# Altium project Street_light_LED_hv2.PrjPcb
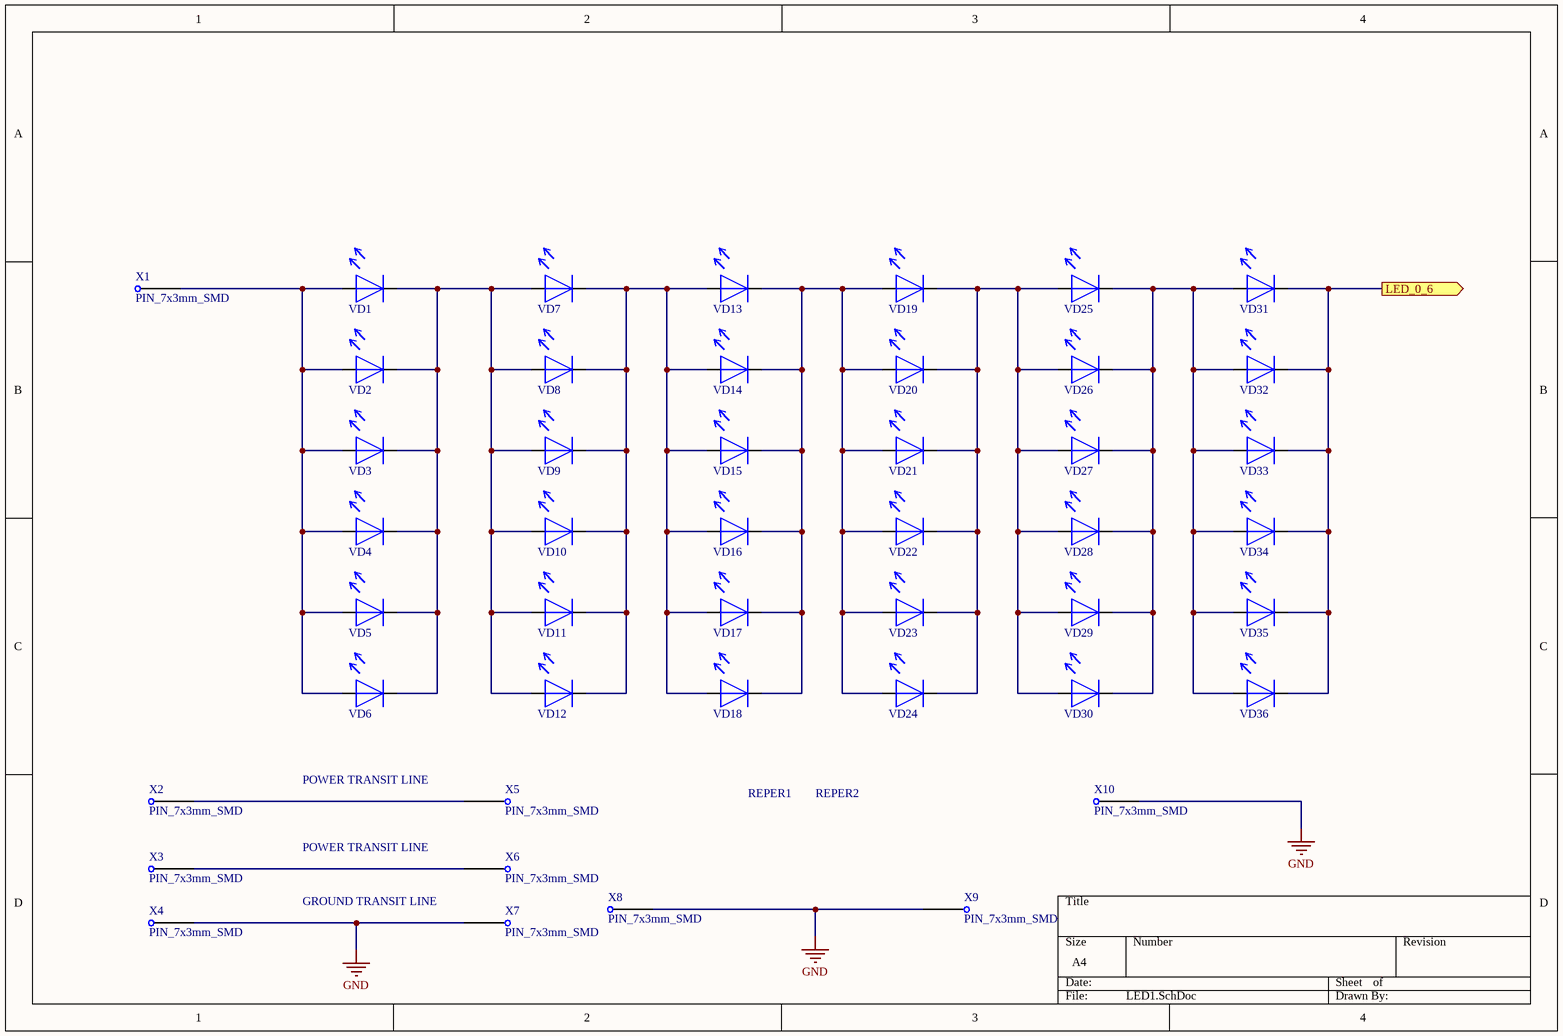
[diagram p0: LED1.SchDoc]
4 sheets, 144 parts. Net scope: flat (ports and power ports of the same name join across sheets).
Board file: Street_light_LED_hv2.PcbDoc
Sheets:
  LED1.SchDoc
  LED2.SchDoc
  LED3.SchDoc
  LED4.SchDoc

## Sheet LED1.SchDoc
size A4

### Parts
1  REPER1  [REPER1.2]
2  REPER2  [REPER1.2]
VD1  SPMWHT541MD5WAT0SB  [LED_Samsung]  (value not drawn)
VD2  SPMWHT541MD5WAT0SB  [LED_Samsung]  (value not drawn)
VD3  SPMWHT541MD5WAT0SB  [LED_Samsung]  (value not drawn)
VD4  SPMWHT541MD5WAT0SB  [LED_Samsung]  (value not drawn)
VD5  SPMWHT541MD5WAT0SB  [LED_Samsung]  (value not drawn)
VD6  SPMWHT541MD5WAT0SB  [LED_Samsung]  (value not drawn)
VD7  SPMWHT541MD5WAT0SB  [LED_Samsung]  (value not drawn)
VD8  SPMWHT541MD5WAT0SB  [LED_Samsung]  (value not drawn)
VD9  SPMWHT541MD5WAT0SB  [LED_Samsung]  (value not drawn)
VD10  SPMWHT541MD5WAT0SB  [LED_Samsung]  (value not drawn)
VD11  SPMWHT541MD5WAT0SB  [LED_Samsung]  (value not drawn)
VD12  SPMWHT541MD5WAT0SB  [LED_Samsung]  (value not drawn)
VD13  SPMWHT541MD5WAT0SB  [LED_Samsung]  (value not drawn)
VD14  SPMWHT541MD5WAT0SB  [LED_Samsung]  (value not drawn)
VD15  SPMWHT541MD5WAT0SB  [LED_Samsung]  (value not drawn)
VD16  SPMWHT541MD5WAT0SB  [LED_Samsung]  (value not drawn)
VD17  SPMWHT541MD5WAT0SB  [LED_Samsung]  (value not drawn)
VD18  SPMWHT541MD5WAT0SB  [LED_Samsung]  (value not drawn)
VD19  SPMWHT541MD5WAT0SB  [LED_Samsung]  (value not drawn)
VD20  SPMWHT541MD5WAT0SB  [LED_Samsung]  (value not drawn)
VD21  SPMWHT541MD5WAT0SB  [LED_Samsung]  (value not drawn)
VD22  SPMWHT541MD5WAT0SB  [LED_Samsung]  (value not drawn)
VD23  SPMWHT541MD5WAT0SB  [LED_Samsung]  (value not drawn)
VD24  SPMWHT541MD5WAT0SB  [LED_Samsung]  (value not drawn)
VD25  SPMWHT541MD5WAT0SB  [LED_Samsung]  (value not drawn)
VD26  SPMWHT541MD5WAT0SB  [LED_Samsung]  (value not drawn)
VD27  SPMWHT541MD5WAT0SB  [LED_Samsung]  (value not drawn)
VD28  SPMWHT541MD5WAT0SB  [LED_Samsung]  (value not drawn)
VD29  SPMWHT541MD5WAT0SB  [LED_Samsung]  (value not drawn)
VD30  SPMWHT541MD5WAT0SB  [LED_Samsung]  (value not drawn)
VD31  SPMWHT541MD5WAT0SB  [LED_Samsung]  (value not drawn)
VD32  SPMWHT541MD5WAT0SB  [LED_Samsung]  (value not drawn)
VD33  SPMWHT541MD5WAT0SB  [LED_Samsung]  (value not drawn)
VD34  SPMWHT541MD5WAT0SB  [LED_Samsung]  (value not drawn)
VD35  SPMWHT541MD5WAT0SB  [LED_Samsung]  (value not drawn)
VD36  SPMWHT541MD5WAT0SB  [LED_Samsung]  (value not drawn)
X1  PIN_7x3mm_SMD  [PIN_7x3mm_SMD]
X2  PIN_7x3mm_SMD  [PIN_7x3mm_SMD]
X3  PIN_7x3mm_SMD  [PIN_7x3mm_SMD]
X4  PIN_7x3mm_SMD  [PIN_7x3mm_SMD]
X5  PIN_7x3mm_SMD  [PIN_7x3mm_SMD]
X6  PIN_7x3mm_SMD  [PIN_7x3mm_SMD]
X7  PIN_7x3mm_SMD  [PIN_7x3mm_SMD]
X8  PIN_7x3mm_SMD  [PIN_7x3mm_SMD]
X9  PIN_7x3mm_SMD  [PIN_7x3mm_SMD]
X10  PIN_7x3mm_SMD  [PIN_7x3mm_SMD]

### Ports
LED_0_6 (out)

### Nets
GND: X4.1 X7.1 X8.1 X9.1 X10.1
NetVD1_1: VD1.1 VD2.1 VD3.1 VD4.1 VD5.1 VD6.1 X1.1
NetVD1_2: VD1.2 VD2.2 VD3.2 VD4.2 VD5.2 VD6.2 VD7.1 VD8.1 VD9.1 VD10.1 VD11.1 VD12.1
NetVD7_2: VD7.2 VD8.2 VD9.2 VD10.2 VD11.2 VD12.2 VD13.1 VD14.1 VD15.1 VD16.1 VD17.1 VD18.1
NetVD13_2: VD13.2 VD14.2 VD15.2 VD16.2 VD17.2 VD18.2 VD19.1 VD20.1 VD21.1 VD22.1 VD23.1 VD24.1
NetVD19_2: VD19.2 VD20.2 VD21.2 VD22.2 VD23.2 VD24.2 VD25.1 VD26.1 VD27.1 VD28.1 VD29.1 VD30.1
NetVD25_2: VD25.2 VD26.2 VD27.2 VD28.2 VD29.2 VD30.2 VD31.1 VD32.1 VD33.1 VD34.1 VD35.1 VD36.1
NetVD31_2: VD31.2 VD32.2 VD33.2 VD34.2 VD35.2 VD36.2 ; port LED_0_6
NetX2_1: X2.1 X5.1
NetX3_1: X3.1 X6.1

Not connected (* = marked no-connect by the designer): 1 1; 2 1

### Notes on the sheet
- POWER TRANSIT LINE
- GROUND TRANSIT LINE

### Library data of the parts
1 2 = REPER1.2
  1: Value: REPER1
  2: Value: REPER2
VD1-VD36 = LED SPMWHT541MD5WAT0SB: Value: SPMWHT541MD5WAT0SB

## Sheet LED2.SchDoc
size A4
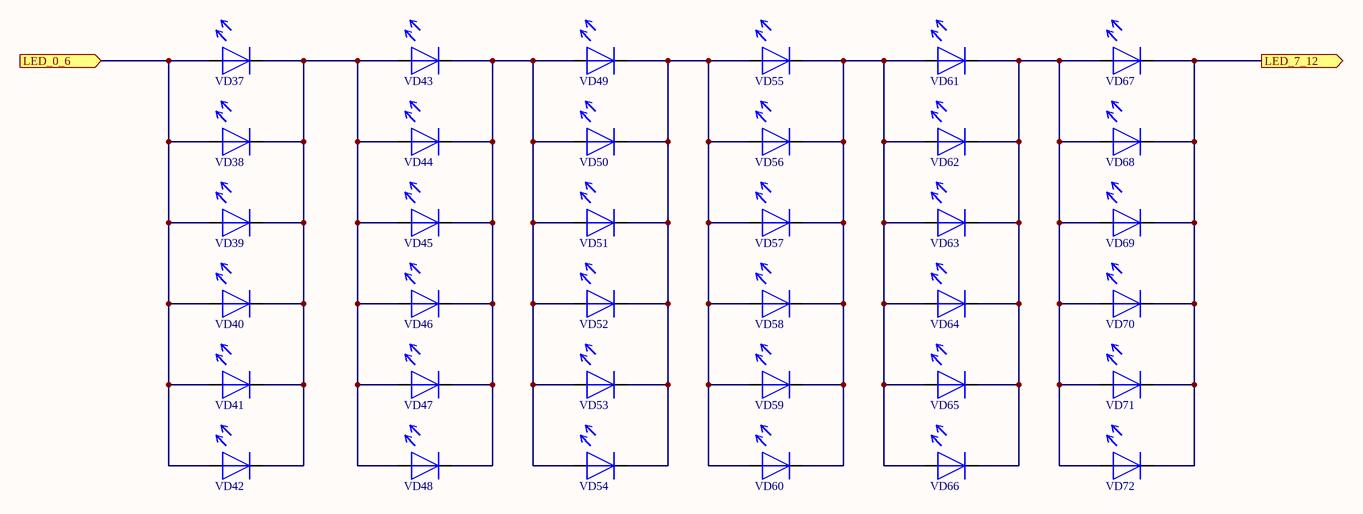
[diagram p1: LED2.SchDoc]

### Parts
VD37  SPMWHT541MD5WAT0SB  [LED_Samsung]  (value not drawn)
VD38  SPMWHT541MD5WAT0SB  [LED_Samsung]  (value not drawn)
VD39  SPMWHT541MD5WAT0SB  [LED_Samsung]  (value not drawn)
VD40  SPMWHT541MD5WAT0SB  [LED_Samsung]  (value not drawn)
VD41  SPMWHT541MD5WAT0SB  [LED_Samsung]  (value not drawn)
VD42  SPMWHT541MD5WAT0SB  [LED_Samsung]  (value not drawn)
VD43  SPMWHT541MD5WAT0SB  [LED_Samsung]  (value not drawn)
VD44  SPMWHT541MD5WAT0SB  [LED_Samsung]  (value not drawn)
VD45  SPMWHT541MD5WAT0SB  [LED_Samsung]  (value not drawn)
VD46  SPMWHT541MD5WAT0SB  [LED_Samsung]  (value not drawn)
VD47  SPMWHT541MD5WAT0SB  [LED_Samsung]  (value not drawn)
VD48  SPMWHT541MD5WAT0SB  [LED_Samsung]  (value not drawn)
VD49  SPMWHT541MD5WAT0SB  [LED_Samsung]  (value not drawn)
VD50  SPMWHT541MD5WAT0SB  [LED_Samsung]  (value not drawn)
VD51  SPMWHT541MD5WAT0SB  [LED_Samsung]  (value not drawn)
VD52  SPMWHT541MD5WAT0SB  [LED_Samsung]  (value not drawn)
VD53  SPMWHT541MD5WAT0SB  [LED_Samsung]  (value not drawn)
VD54  SPMWHT541MD5WAT0SB  [LED_Samsung]  (value not drawn)
VD55  SPMWHT541MD5WAT0SB  [LED_Samsung]  (value not drawn)
VD56  SPMWHT541MD5WAT0SB  [LED_Samsung]  (value not drawn)
VD57  SPMWHT541MD5WAT0SB  [LED_Samsung]  (value not drawn)
VD58  SPMWHT541MD5WAT0SB  [LED_Samsung]  (value not drawn)
VD59  SPMWHT541MD5WAT0SB  [LED_Samsung]  (value not drawn)
VD60  SPMWHT541MD5WAT0SB  [LED_Samsung]  (value not drawn)
VD61  SPMWHT541MD5WAT0SB  [LED_Samsung]  (value not drawn)
VD62  SPMWHT541MD5WAT0SB  [LED_Samsung]  (value not drawn)
VD63  SPMWHT541MD5WAT0SB  [LED_Samsung]  (value not drawn)
VD64  SPMWHT541MD5WAT0SB  [LED_Samsung]  (value not drawn)
VD65  SPMWHT541MD5WAT0SB  [LED_Samsung]  (value not drawn)
VD66  SPMWHT541MD5WAT0SB  [LED_Samsung]  (value not drawn)
VD67  SPMWHT541MD5WAT0SB  [LED_Samsung]  (value not drawn)
VD68  SPMWHT541MD5WAT0SB  [LED_Samsung]  (value not drawn)
VD69  SPMWHT541MD5WAT0SB  [LED_Samsung]  (value not drawn)
VD70  SPMWHT541MD5WAT0SB  [LED_Samsung]  (value not drawn)
VD71  SPMWHT541MD5WAT0SB  [LED_Samsung]  (value not drawn)
VD72  SPMWHT541MD5WAT0SB  [LED_Samsung]  (value not drawn)

### Ports
LED_0_6 (in), LED_7_12 (out)

### Nets
NetVD31_2: VD37.1 VD38.1 VD39.1 VD40.1 VD41.1 VD42.1 ; port LED_0_6
NetVD37_2: VD37.2 VD38.2 VD39.2 VD40.2 VD41.2 VD42.2 VD43.1 VD44.1 VD45.1 VD46.1 VD47.1 VD48.1
NetVD43_2: VD43.2 VD44.2 VD45.2 VD46.2 VD47.2 VD48.2 VD49.1 VD50.1 VD51.1 VD52.1 VD53.1 VD54.1
NetVD49_2: VD49.2 VD50.2 VD51.2 VD52.2 VD53.2 VD54.2 VD55.1 VD56.1 VD57.1 VD58.1 VD59.1 VD60.1
NetVD55_2: VD55.2 VD56.2 VD57.2 VD58.2 VD59.2 VD60.2 VD61.1 VD62.1 VD63.1 VD64.1 VD65.1 VD66.1
NetVD61_2: VD61.2 VD62.2 VD63.2 VD64.2 VD65.2 VD66.2 VD67.1 VD68.1 VD69.1 VD70.1 VD71.1 VD72.1
NetVD67_2: VD67.2 VD68.2 VD69.2 VD70.2 VD71.2 VD72.2 ; port LED_7_12

### Library data of the parts
VD37-VD72 = LED SPMWHT541MD5WAT0SB: Value: SPMWHT541MD5WAT0SB

## Sheet LED3.SchDoc
size A4
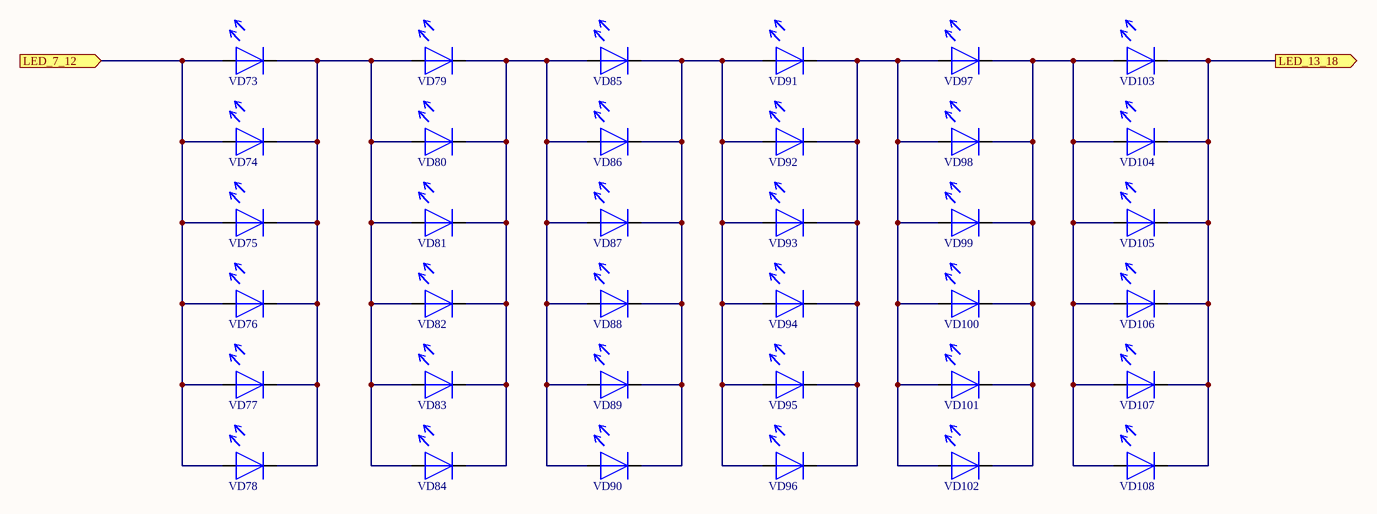
[diagram p2: LED3.SchDoc]

### Parts
VD73  SPMWHT541MD5WAT0SB  [LED_Samsung]  (value not drawn)
VD74  SPMWHT541MD5WAT0SB  [LED_Samsung]  (value not drawn)
VD75  SPMWHT541MD5WAT0SB  [LED_Samsung]  (value not drawn)
VD76  SPMWHT541MD5WAT0SB  [LED_Samsung]  (value not drawn)
VD77  SPMWHT541MD5WAT0SB  [LED_Samsung]  (value not drawn)
VD78  SPMWHT541MD5WAT0SB  [LED_Samsung]  (value not drawn)
VD79  SPMWHT541MD5WAT0SB  [LED_Samsung]  (value not drawn)
VD80  SPMWHT541MD5WAT0SB  [LED_Samsung]  (value not drawn)
VD81  SPMWHT541MD5WAT0SB  [LED_Samsung]  (value not drawn)
VD82  SPMWHT541MD5WAT0SB  [LED_Samsung]  (value not drawn)
VD83  SPMWHT541MD5WAT0SB  [LED_Samsung]  (value not drawn)
VD84  SPMWHT541MD5WAT0SB  [LED_Samsung]  (value not drawn)
VD85  SPMWHT541MD5WAT0SB  [LED_Samsung]  (value not drawn)
VD86  SPMWHT541MD5WAT0SB  [LED_Samsung]  (value not drawn)
VD87  SPMWHT541MD5WAT0SB  [LED_Samsung]  (value not drawn)
VD88  SPMWHT541MD5WAT0SB  [LED_Samsung]  (value not drawn)
VD89  SPMWHT541MD5WAT0SB  [LED_Samsung]  (value not drawn)
VD90  SPMWHT541MD5WAT0SB  [LED_Samsung]  (value not drawn)
VD91  SPMWHT541MD5WAT0SB  [LED_Samsung]  (value not drawn)
VD92  SPMWHT541MD5WAT0SB  [LED_Samsung]  (value not drawn)
VD93  SPMWHT541MD5WAT0SB  [LED_Samsung]  (value not drawn)
VD94  SPMWHT541MD5WAT0SB  [LED_Samsung]  (value not drawn)
VD95  SPMWHT541MD5WAT0SB  [LED_Samsung]  (value not drawn)
VD96  SPMWHT541MD5WAT0SB  [LED_Samsung]  (value not drawn)
VD97  SPMWHT541MD5WAT0SB  [LED_Samsung]  (value not drawn)
VD98  SPMWHT541MD5WAT0SB  [LED_Samsung]  (value not drawn)
VD99  SPMWHT541MD5WAT0SB  [LED_Samsung]  (value not drawn)
VD100  SPMWHT541MD5WAT0SB  [LED_Samsung]  (value not drawn)
VD101  SPMWHT541MD5WAT0SB  [LED_Samsung]  (value not drawn)
VD102  SPMWHT541MD5WAT0SB  [LED_Samsung]  (value not drawn)
VD103  SPMWHT541MD5WAT0SB  [LED_Samsung]  (value not drawn)
VD104  SPMWHT541MD5WAT0SB  [LED_Samsung]  (value not drawn)
VD105  SPMWHT541MD5WAT0SB  [LED_Samsung]  (value not drawn)
VD106  SPMWHT541MD5WAT0SB  [LED_Samsung]  (value not drawn)
VD107  SPMWHT541MD5WAT0SB  [LED_Samsung]  (value not drawn)
VD108  SPMWHT541MD5WAT0SB  [LED_Samsung]  (value not drawn)

### Ports
LED_7_12 (in), LED_13_18 (out)

### Nets
NetVD67_2: VD73.1 VD74.1 VD75.1 VD76.1 VD77.1 VD78.1 ; port LED_7_12
NetVD73_2: VD73.2 VD74.2 VD75.2 VD76.2 VD77.2 VD78.2 VD79.1 VD80.1 VD81.1 VD82.1 VD83.1 VD84.1
NetVD79_2: VD79.2 VD80.2 VD81.2 VD82.2 VD83.2 VD84.2 VD85.1 VD86.1 VD87.1 VD88.1 VD89.1 VD90.1
NetVD85_2: VD85.2 VD86.2 VD87.2 VD88.2 VD89.2 VD90.2 VD91.1 VD92.1 VD93.1 VD94.1 VD95.1 VD96.1
NetVD91_2: VD91.2 VD92.2 VD93.2 VD94.2 VD95.2 VD96.2 VD97.1 VD98.1 VD99.1 VD100.1 VD101.1 VD102.1
NetVD97_2: VD97.2 VD98.2 VD99.2 VD100.2 VD101.2 VD102.2 VD103.1 VD104.1 VD105.1 VD106.1 VD107.1 VD108.1
NetVD103_2: VD103.2 VD104.2 VD105.2 VD106.2 VD107.2 VD108.2 ; port LED_13_18

### Library data of the parts
VD73-VD108 = LED SPMWHT541MD5WAT0SB: Value: SPMWHT541MD5WAT0SB

## Sheet LED4.SchDoc
size A4
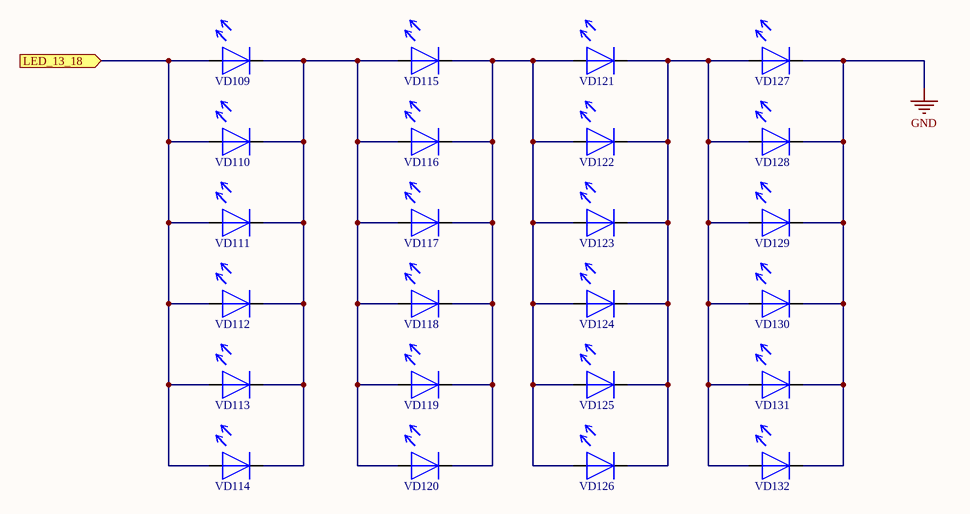
[diagram p3: LED4.SchDoc]

### Parts
VD109  SPMWHT541MD5WAT0SB  [LED_Samsung]  (value not drawn)
VD110  SPMWHT541MD5WAT0SB  [LED_Samsung]  (value not drawn)
VD111  SPMWHT541MD5WAT0SB  [LED_Samsung]  (value not drawn)
VD112  SPMWHT541MD5WAT0SB  [LED_Samsung]  (value not drawn)
VD113  SPMWHT541MD5WAT0SB  [LED_Samsung]  (value not drawn)
VD114  SPMWHT541MD5WAT0SB  [LED_Samsung]  (value not drawn)
VD115  SPMWHT541MD5WAT0SB  [LED_Samsung]  (value not drawn)
VD116  SPMWHT541MD5WAT0SB  [LED_Samsung]  (value not drawn)
VD117  SPMWHT541MD5WAT0SB  [LED_Samsung]  (value not drawn)
VD118  SPMWHT541MD5WAT0SB  [LED_Samsung]  (value not drawn)
VD119  SPMWHT541MD5WAT0SB  [LED_Samsung]  (value not drawn)
VD120  SPMWHT541MD5WAT0SB  [LED_Samsung]  (value not drawn)
VD121  SPMWHT541MD5WAT0SB  [LED_Samsung]  (value not drawn)
VD122  SPMWHT541MD5WAT0SB  [LED_Samsung]  (value not drawn)
VD123  SPMWHT541MD5WAT0SB  [LED_Samsung]  (value not drawn)
VD124  SPMWHT541MD5WAT0SB  [LED_Samsung]  (value not drawn)
VD125  SPMWHT541MD5WAT0SB  [LED_Samsung]  (value not drawn)
VD126  SPMWHT541MD5WAT0SB  [LED_Samsung]  (value not drawn)
VD127  SPMWHT541MD5WAT0SB  [LED_Samsung]  (value not drawn)
VD128  SPMWHT541MD5WAT0SB  [LED_Samsung]  (value not drawn)
VD129  SPMWHT541MD5WAT0SB  [LED_Samsung]  (value not drawn)
VD130  SPMWHT541MD5WAT0SB  [LED_Samsung]  (value not drawn)
VD131  SPMWHT541MD5WAT0SB  [LED_Samsung]  (value not drawn)
VD132  SPMWHT541MD5WAT0SB  [LED_Samsung]  (value not drawn)

### Ports
LED_13_18 (in)

### Nets
GND: VD127.2 VD128.2 VD129.2 VD130.2 VD131.2 VD132.2
NetVD103_2: VD109.1 VD110.1 VD111.1 VD112.1 VD113.1 VD114.1 ; port LED_13_18
NetVD109_2: VD109.2 VD110.2 VD111.2 VD112.2 VD113.2 VD114.2 VD115.1 VD116.1 VD117.1 VD118.1 VD119.1 VD120.1
NetVD115_2: VD115.2 VD116.2 VD117.2 VD118.2 VD119.2 VD120.2 VD121.1 VD122.1 VD123.1 VD124.1 VD125.1 VD126.1
NetVD121_2: VD121.2 VD122.2 VD123.2 VD124.2 VD125.2 VD126.2 VD127.1 VD128.1 VD129.1 VD130.1 VD131.1 VD132.1

### Library data of the parts
VD109-VD132 = LED SPMWHT541MD5WAT0SB: Value: SPMWHT541MD5WAT0SB

## Nets that join several sheets
GND: LED1 (5 pins), LED4 (6 pins)
NetVD31_2: LED1 (6 pins), LED2 (6 pins)
NetVD67_2: LED2 (6 pins), LED3 (6 pins)
NetVD103_2: LED3 (6 pins), LED4 (6 pins)